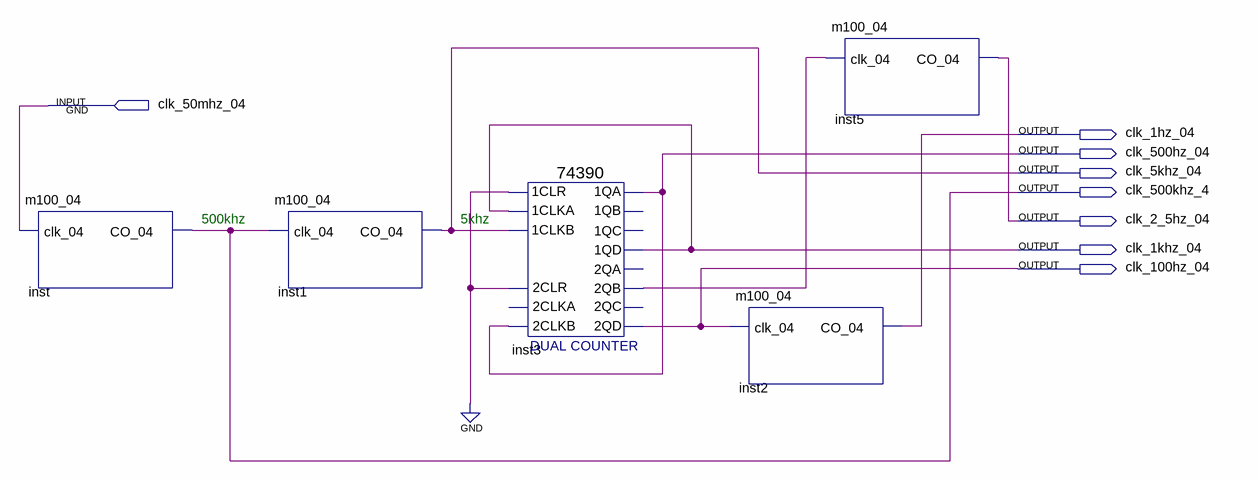
[diagram p0: schematic sheet]
// Quartus schematic fre_div_04.bdf as structural Verilog: 5 symbols, 8 pins
module fre_div_04 (
  input  clk_50mhz_04,
  output clk_1hz_04,
  output clk_500hz_04,
  output clk_5khz_04,
  output clk_500khz_4,
  output clk_2_5hz_04,
  output clk_1khz_04,
  output clk_100hz_04
);

  wire inst3_2qb;

  m100_04 inst (.clk_04(clk_50mhz_04), .CO_04(clk_500khz_4));
  m100_04 inst1 (.clk_04(clk_500khz_4), .CO_04(clk_5khz_04));
  \74390  inst3 (
    .\2CLR (1'b0), .\2CLKB (clk_500hz_04), .\1CLR (1'b0), .\1CLKA (clk_1khz_04), .\1CLKB (clk_5khz_04),
    .\1QA (clk_500hz_04), .\1QD (clk_1khz_04), .\2QB (inst3_2qb), .\2QD (clk_100hz_04));  // open: 2CLKA, 1QB, 1QC, 2QA, 2QC
  m100_04 inst2 (.clk_04(clk_100hz_04), .CO_04(clk_1hz_04));
  m100_04 inst5 (.clk_04(inst3_2qb), .CO_04(clk_2_5hz_04));

  // Notes on the sheet:
  //   500khz
  //   5khz
endmodule
